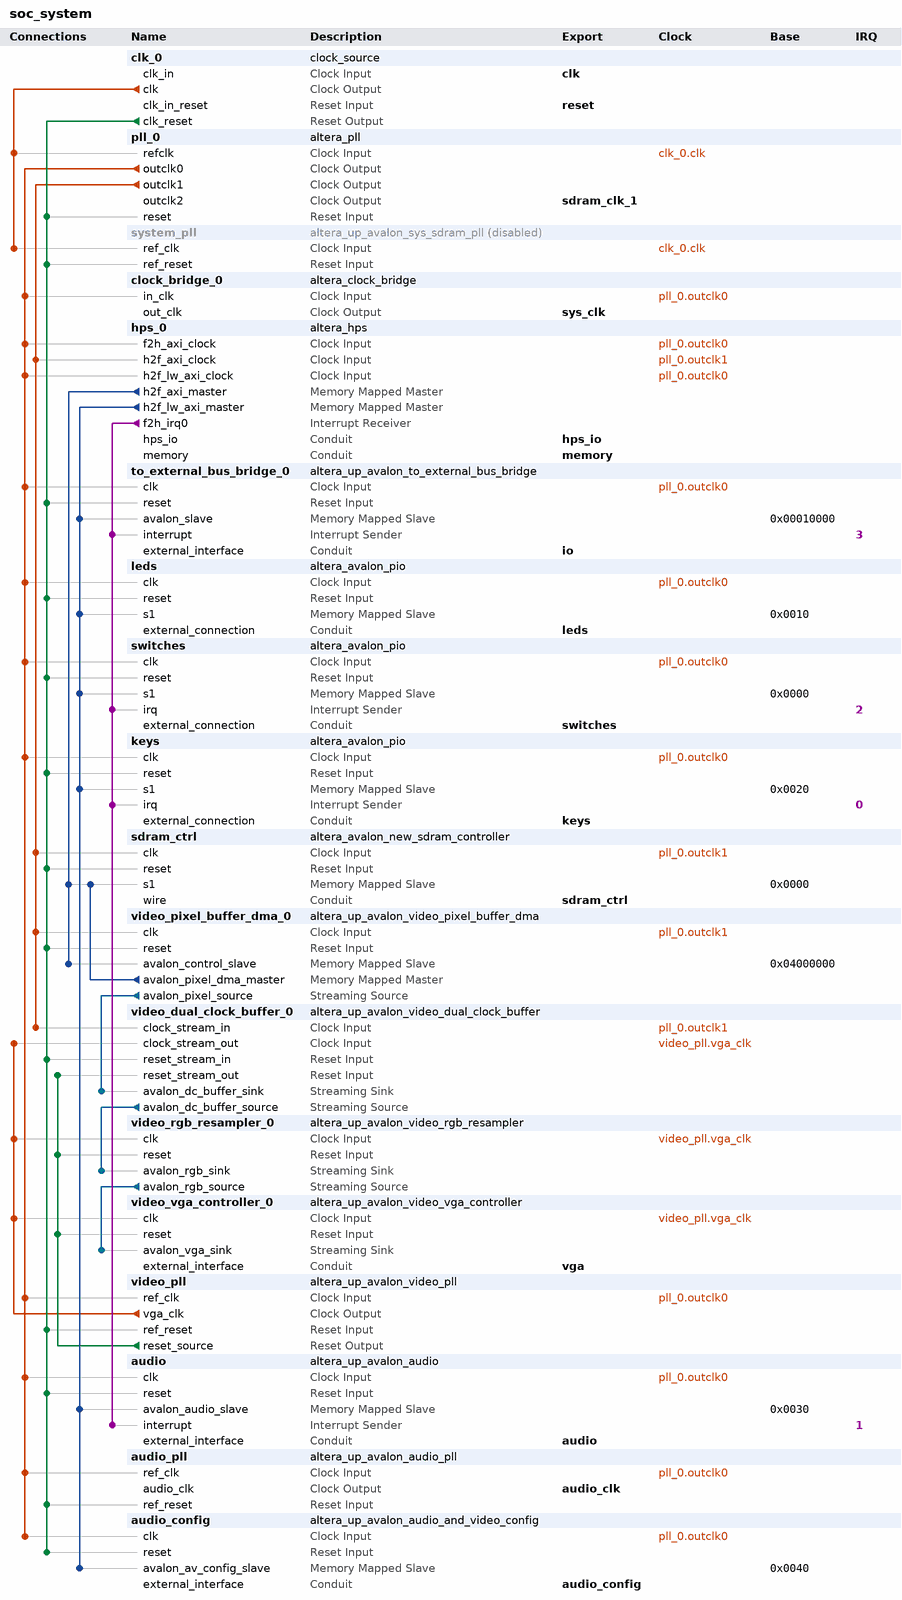
[diagram p0: system contents]
# Platform Designer (Qsys) system soc_system, Cyclone V 5CSEMA5F31C6
# Parameters at their usual value, and those the tool derives, are not listed.
package require -exact qsys 15.0
create_system soc_system
set_project_property DEVICE_FAMILY {Cyclone V}
set_project_property DEVICE 5CSEMA5F31C6

add_instance clk_0 clock_source 15.0
set_instance_parameter_value clk_0 clockFrequency 50000000

add_instance pll_0 altera_pll 15.0
set_instance_parameter_value pll_0 gui_actual_phase_shift2 {306.0 deg}
set_instance_parameter_value pll_0 gui_device_speed_grade 1
set_instance_parameter_value pll_0 gui_number_of_clocks 3
set_instance_parameter_value pll_0 gui_operation_mode direct
set_instance_parameter_value pll_0 gui_output_clock_frequency0 50.0
set_instance_parameter_value pll_0 gui_output_clock_frequency1 143.0
set_instance_parameter_value pll_0 gui_output_clock_frequency2 143.0
set_instance_parameter_value pll_0 gui_phase_shift2 -3000
set_instance_parameter_value pll_0 gui_pll_mode {Integer-N PLL}
set_instance_parameter_value pll_0 gui_reference_clock_frequency 50.0
set_instance_parameter_value pll_0 gui_use_locked false

add_instance system_pll altera_up_avalon_sys_sdram_pll 15.0
set_instance_property system_pll ENABLED false
set_instance_parameter_value system_pll CV_boards DE1-SoC
set_instance_parameter_value system_pll gui_outclk 50.0
set_instance_parameter_value system_pll gui_refclk 50.0

add_instance clock_bridge_0 altera_clock_bridge 15.0
set_instance_parameter_value clock_bridge_0 DERIVED_CLOCK_RATE 50000000
set_instance_parameter_value clock_bridge_0 EXPLICIT_CLOCK_RATE 50000000

add_instance hps_0 altera_hps 15.0
set_instance_parameter_value hps_0 EMAC1_Mode RGMII
set_instance_parameter_value hps_0 EMAC1_PinMuxing {HPS I/O Set 0}
set_instance_parameter_value hps_0 F2SCLK_COLDRST_Enable false
set_instance_parameter_value hps_0 F2SCLK_DBGRST_Enable false
set_instance_parameter_value hps_0 F2SCLK_WARMRST_Enable false
set_instance_parameter_value hps_0 F2SINTERRUPT_Enable true
set_instance_parameter_value hps_0 F2S_Width 3
set_instance_parameter_value hps_0 FPGA_PERIPHERAL_OUTPUT_CLOCK_FREQ_EMAC0_GTX_CLK 100
set_instance_parameter_value hps_0 FPGA_PERIPHERAL_OUTPUT_CLOCK_FREQ_EMAC0_MD_CLK 2.5
set_instance_parameter_value hps_0 FPGA_PERIPHERAL_OUTPUT_CLOCK_FREQ_EMAC1_GTX_CLK 100
set_instance_parameter_value hps_0 FPGA_PERIPHERAL_OUTPUT_CLOCK_FREQ_EMAC1_MD_CLK 2.5
set_instance_parameter_value hps_0 HPS_PROTOCOL DDR3
set_instance_parameter_value hps_0 I2C0_Mode N/A
set_instance_parameter_value hps_0 I2C0_PinMuxing Unused
set_instance_parameter_value hps_0 I2C1_Mode N/A
set_instance_parameter_value hps_0 I2C1_PinMuxing Unused
set_instance_parameter_value hps_0 LWH2F_Enable true
set_instance_parameter_value hps_0 MEM_BANKADDR_WIDTH 3
set_instance_parameter_value hps_0 MEM_CLK_FREQ 400.0
set_instance_parameter_value hps_0 MEM_COL_ADDR_WIDTH 10
set_instance_parameter_value hps_0 MEM_DQ_WIDTH 32
set_instance_parameter_value hps_0 MEM_DRV_STR RZQ/7
set_instance_parameter_value hps_0 MEM_ROW_ADDR_WIDTH 15
set_instance_parameter_value hps_0 MEM_RTT_NOM RZQ/4
set_instance_parameter_value hps_0 MEM_RTT_WR {Dynamic ODT off}
set_instance_parameter_value hps_0 MEM_TCL 11
set_instance_parameter_value hps_0 MEM_TFAW_NS 30.0
set_instance_parameter_value hps_0 MEM_TRAS_NS 35.0
set_instance_parameter_value hps_0 MEM_TRCD_NS 13.75
set_instance_parameter_value hps_0 MEM_TRFC_NS 260.0
set_instance_parameter_value hps_0 MEM_TRP_NS 13.75
set_instance_parameter_value hps_0 MEM_VENDOR JEDEC
set_instance_parameter_value hps_0 MEM_WTCL 8
set_instance_parameter_value hps_0 QSPI_Mode N/A
set_instance_parameter_value hps_0 QSPI_PinMuxing Unused
set_instance_parameter_value hps_0 REF_CLK_FREQ 25.0
set_instance_parameter_value hps_0 S2F_Width 1
set_instance_parameter_value hps_0 SDIO_Mode {4-bit Data}
set_instance_parameter_value hps_0 SDIO_PinMuxing {HPS I/O Set 0}
set_instance_parameter_value hps_0 SPIM1_Mode N/A
set_instance_parameter_value hps_0 SPIM1_PinMuxing Unused
set_instance_parameter_value hps_0 STM_Enable false
set_instance_parameter_value hps_0 TIMING_BOARD_AC_SKEW 0.03
set_instance_parameter_value hps_0 TIMING_BOARD_AC_TO_CK_SKEW 0.0
set_instance_parameter_value hps_0 TIMING_BOARD_DQ_TO_DQS_SKEW 0.0
set_instance_parameter_value hps_0 TIMING_BOARD_MAX_CK_DELAY 0.03
set_instance_parameter_value hps_0 TIMING_BOARD_MAX_DQS_DELAY 0.02
set_instance_parameter_value hps_0 TIMING_BOARD_SKEW_BETWEEN_DQS 0.08
set_instance_parameter_value hps_0 TIMING_BOARD_SKEW_CKDQS_DIMM_MAX 0.16
set_instance_parameter_value hps_0 TIMING_BOARD_SKEW_CKDQS_DIMM_MIN 0.09
set_instance_parameter_value hps_0 TIMING_BOARD_SKEW_WITHIN_DQS 0.01
set_instance_parameter_value hps_0 TIMING_TDH 65
set_instance_parameter_value hps_0 TIMING_TDQSCK 255
set_instance_parameter_value hps_0 TIMING_TDQSQ 125
set_instance_parameter_value hps_0 TIMING_TDS 30
set_instance_parameter_value hps_0 TIMING_TIH 140
set_instance_parameter_value hps_0 TIMING_TIS 180
set_instance_parameter_value hps_0 TIMING_TQSH 0.4
set_instance_parameter_value hps_0 UART0_Mode {No Flow Control}
set_instance_parameter_value hps_0 UART0_PinMuxing {HPS I/O Set 0}
set_instance_parameter_value hps_0 USB1_Mode N/A
set_instance_parameter_value hps_0 USB1_PinMuxing Unused
set_instance_parameter_value hps_0 desired_cfg_clk_mhz 100.0
set_instance_parameter_value hps_0 desired_qspi_clk_mhz 400.0

add_instance to_external_bus_bridge_0 altera_up_avalon_to_external_bus_bridge 15.0
set_instance_parameter_value to_external_bus_bridge_0 addr_size 64
set_instance_parameter_value to_external_bus_bridge_0 addr_size_multiplier Kbytes
set_instance_parameter_value to_external_bus_bridge_0 data_size 16

add_instance leds altera_avalon_pio 15.0
set_instance_parameter_value leds direction Output
set_instance_parameter_value leds resetValue 1023
set_instance_parameter_value leds width 10

add_instance switches altera_avalon_pio 15.0
set_instance_parameter_value switches bitClearingEdgeCapReg true
set_instance_parameter_value switches captureEdge true
set_instance_parameter_value switches direction Input
set_instance_parameter_value switches generateIRQ true
set_instance_parameter_value switches irqType EDGE
set_instance_parameter_value switches width 10

add_instance keys altera_avalon_pio 15.0
set_instance_parameter_value keys bitClearingEdgeCapReg true
set_instance_parameter_value keys captureEdge true
set_instance_parameter_value keys direction Input
set_instance_parameter_value keys edgeType FALLING
set_instance_parameter_value keys generateIRQ true
set_instance_parameter_value keys irqType EDGE
set_instance_parameter_value keys width 4

add_instance sdram_ctrl altera_avalon_new_sdram_controller 15.0
set_instance_parameter_value sdram_ctrl TAC 5.5
set_instance_parameter_value sdram_ctrl TRCD 15.0
set_instance_parameter_value sdram_ctrl TRP 15.0
set_instance_parameter_value sdram_ctrl casLatency 3
set_instance_parameter_value sdram_ctrl columnWidth 10
set_instance_parameter_value sdram_ctrl dataWidth 16
set_instance_parameter_value sdram_ctrl generateSimulationModel false
set_instance_parameter_value sdram_ctrl model single_Micron_MT48LC4M32B2_7_chip
set_instance_parameter_value sdram_ctrl numberOfBanks 4
set_instance_parameter_value sdram_ctrl numberOfChipSelects 1
set_instance_parameter_value sdram_ctrl powerUpDelay 100.0
set_instance_parameter_value sdram_ctrl refreshPeriod 7.8
set_instance_parameter_value sdram_ctrl rowWidth 13

add_instance video_pixel_buffer_dma_0 altera_up_avalon_video_pixel_buffer_dma 15.0
set_instance_parameter_value video_pixel_buffer_dma_0 addr_mode Consecutive
set_instance_parameter_value video_pixel_buffer_dma_0 back_start_address 0
set_instance_parameter_value video_pixel_buffer_dma_0 color_space {16-bit RGB}
set_instance_parameter_value video_pixel_buffer_dma_0 image_height 480
set_instance_parameter_value video_pixel_buffer_dma_0 image_width 720
set_instance_parameter_value video_pixel_buffer_dma_0 start_address 0

add_instance video_dual_clock_buffer_0 altera_up_avalon_video_dual_clock_buffer 15.0
set_instance_parameter_value video_dual_clock_buffer_0 color_bits 16
set_instance_parameter_value video_dual_clock_buffer_0 color_planes 1

add_instance video_rgb_resampler_0 altera_up_avalon_video_rgb_resampler 15.0
set_instance_parameter_value video_rgb_resampler_0 alpha 1023
set_instance_parameter_value video_rgb_resampler_0 input_type {16-bit RGB}
set_instance_parameter_value video_rgb_resampler_0 output_type {30-bit RGB}

add_instance video_vga_controller_0 altera_up_avalon_video_vga_controller 15.0
set_instance_parameter_value video_vga_controller_0 board DE1-SoC
set_instance_parameter_value video_vga_controller_0 resolution {SDTV 720x480}

add_instance video_pll altera_up_avalon_video_pll 15.0
set_instance_parameter_value video_pll camera {5MP Digital Camera}
set_instance_parameter_value video_pll gui_refclk 50.0
set_instance_parameter_value video_pll gui_resolution {SDTV 720x480}
set_instance_parameter_value video_pll lcd {7" LCD on VEEK-MT and MTL Module}

add_instance audio altera_up_avalon_audio 15.0
set_instance_parameter_value audio audio_in true
set_instance_parameter_value audio avalon_bus_type {Memory Mapped}
set_instance_parameter_value audio dw 16

add_instance audio_pll altera_up_avalon_audio_pll 15.0
set_instance_parameter_value audio_pll gui_refclk 50.0

add_instance audio_config altera_up_avalon_audio_and_video_config 15.0
set_instance_parameter_value audio_config audio_in {Microphone to ADC}
set_instance_parameter_value audio_config bit_length 16
set_instance_parameter_value audio_config board DE1-SoC
set_instance_parameter_value audio_config line_in_bypass false
set_instance_parameter_value audio_config sampling_rate {32 kHz}

# connections
add_connection clk_0.clk pll_0.refclk clock
add_connection clk_0.clk system_pll.ref_clk clock
add_connection pll_0.outclk0 audio.clk clock
add_connection pll_0.outclk0 audio_config.clk clock
add_connection pll_0.outclk0 audio_pll.ref_clk clock
add_connection pll_0.outclk0 clock_bridge_0.in_clk clock
add_connection pll_0.outclk0 hps_0.f2h_axi_clock clock
add_connection pll_0.outclk0 hps_0.h2f_lw_axi_clock clock
add_connection pll_0.outclk0 keys.clk clock
add_connection pll_0.outclk0 leds.clk clock
add_connection pll_0.outclk0 switches.clk clock
add_connection pll_0.outclk0 to_external_bus_bridge_0.clk clock
add_connection pll_0.outclk0 video_pll.ref_clk clock
add_connection pll_0.outclk1 hps_0.h2f_axi_clock clock
add_connection pll_0.outclk1 sdram_ctrl.clk clock
add_connection pll_0.outclk1 video_dual_clock_buffer_0.clock_stream_in clock
add_connection pll_0.outclk1 video_pixel_buffer_dma_0.clk clock
add_connection video_pll.vga_clk video_dual_clock_buffer_0.clock_stream_out clock
add_connection video_pll.vga_clk video_rgb_resampler_0.clk clock
add_connection video_pll.vga_clk video_vga_controller_0.clk clock
add_connection clk_0.clk_reset audio.reset reset
add_connection clk_0.clk_reset audio_config.reset reset
add_connection clk_0.clk_reset audio_pll.ref_reset reset
add_connection clk_0.clk_reset keys.reset reset
add_connection clk_0.clk_reset leds.reset reset
add_connection clk_0.clk_reset pll_0.reset reset
add_connection clk_0.clk_reset sdram_ctrl.reset reset
add_connection clk_0.clk_reset switches.reset reset
add_connection clk_0.clk_reset system_pll.ref_reset reset
add_connection clk_0.clk_reset to_external_bus_bridge_0.reset reset
add_connection clk_0.clk_reset video_dual_clock_buffer_0.reset_stream_in reset
add_connection clk_0.clk_reset video_pixel_buffer_dma_0.reset reset
add_connection clk_0.clk_reset video_pll.ref_reset reset
add_connection video_pll.reset_source video_dual_clock_buffer_0.reset_stream_out reset
add_connection video_pll.reset_source video_rgb_resampler_0.reset reset
add_connection video_pll.reset_source video_vga_controller_0.reset reset
add_connection hps_0.h2f_axi_master sdram_ctrl.s1 avalon
set_connection_parameter_value hps_0.h2f_axi_master/sdram_ctrl.s1 baseAddress 0x0000
add_connection hps_0.h2f_axi_master video_pixel_buffer_dma_0.avalon_control_slave avalon
set_connection_parameter_value hps_0.h2f_axi_master/video_pixel_buffer_dma_0.avalon_control_slave baseAddress 0x04000000
add_connection hps_0.h2f_lw_axi_master audio.avalon_audio_slave avalon
set_connection_parameter_value hps_0.h2f_lw_axi_master/audio.avalon_audio_slave baseAddress 0x0030
add_connection hps_0.h2f_lw_axi_master audio_config.avalon_av_config_slave avalon
set_connection_parameter_value hps_0.h2f_lw_axi_master/audio_config.avalon_av_config_slave baseAddress 0x0040
add_connection hps_0.h2f_lw_axi_master keys.s1 avalon
set_connection_parameter_value hps_0.h2f_lw_axi_master/keys.s1 baseAddress 0x0020
add_connection hps_0.h2f_lw_axi_master leds.s1 avalon
set_connection_parameter_value hps_0.h2f_lw_axi_master/leds.s1 baseAddress 0x0010
add_connection hps_0.h2f_lw_axi_master switches.s1 avalon
set_connection_parameter_value hps_0.h2f_lw_axi_master/switches.s1 baseAddress 0x0000
add_connection hps_0.h2f_lw_axi_master to_external_bus_bridge_0.avalon_slave avalon
set_connection_parameter_value hps_0.h2f_lw_axi_master/to_external_bus_bridge_0.avalon_slave baseAddress 0x00010000
add_connection video_pixel_buffer_dma_0.avalon_pixel_dma_master sdram_ctrl.s1 avalon
set_connection_parameter_value video_pixel_buffer_dma_0.avalon_pixel_dma_master/sdram_ctrl.s1 baseAddress 0x0000
add_connection video_dual_clock_buffer_0.avalon_dc_buffer_source video_rgb_resampler_0.avalon_rgb_sink avalon_streaming
add_connection video_pixel_buffer_dma_0.avalon_pixel_source video_dual_clock_buffer_0.avalon_dc_buffer_sink avalon_streaming
add_connection video_rgb_resampler_0.avalon_rgb_source video_vga_controller_0.avalon_vga_sink avalon_streaming
add_connection hps_0.f2h_irq0 audio.interrupt interrupt
set_connection_parameter_value hps_0.f2h_irq0/audio.interrupt irqNumber 1
add_connection hps_0.f2h_irq0 keys.irq interrupt
set_connection_parameter_value hps_0.f2h_irq0/keys.irq irqNumber 0
add_connection hps_0.f2h_irq0 switches.irq interrupt
set_connection_parameter_value hps_0.f2h_irq0/switches.irq irqNumber 2
add_connection hps_0.f2h_irq0 to_external_bus_bridge_0.interrupt interrupt
set_connection_parameter_value hps_0.f2h_irq0/to_external_bus_bridge_0.interrupt irqNumber 3

# exported interfaces
add_interface audio conduit end
set_interface_property audio EXPORT_OF audio.external_interface
add_interface audio_clk clock source
set_interface_property audio_clk EXPORT_OF audio_pll.audio_clk
add_interface audio_config conduit end
set_interface_property audio_config EXPORT_OF audio_config.external_interface
add_interface clk clock sink
set_interface_property clk EXPORT_OF clk_0.clk_in
add_interface hps_io conduit end
set_interface_property hps_io EXPORT_OF hps_0.hps_io
add_interface io conduit end
set_interface_property io EXPORT_OF to_external_bus_bridge_0.external_interface
add_interface keys conduit end
set_interface_property keys EXPORT_OF keys.external_connection
add_interface leds conduit end
set_interface_property leds EXPORT_OF leds.external_connection
add_interface memory conduit end
set_interface_property memory EXPORT_OF hps_0.memory
add_interface reset reset sink
set_interface_property reset EXPORT_OF clk_0.clk_in_reset
add_interface sdram_clk_1 clock source
set_interface_property sdram_clk_1 EXPORT_OF pll_0.outclk2
add_interface sdram_ctrl conduit end
set_interface_property sdram_ctrl EXPORT_OF sdram_ctrl.wire
add_interface switches conduit end
set_interface_property switches EXPORT_OF switches.external_connection
add_interface sys_clk clock source
set_interface_property sys_clk EXPORT_OF clock_bridge_0.out_clk
add_interface vga conduit end
set_interface_property vga EXPORT_OF video_vga_controller_0.external_interface

set_interconnect_requirement {$system} qsys_mm.clockCrossingAdapter HANDSHAKE
set_interconnect_requirement {$system} qsys_mm.enableEccProtection FALSE
set_interconnect_requirement {$system} qsys_mm.insertDefaultSlave FALSE
set_interconnect_requirement {$system} qsys_mm.maxAdditionalLatency 1

save_system soc_system.qsys
